# Altium schematic sheet MAIN.SchDoc: FM5006C
size A4; Date: 8/17/2024; Organization: Altium Limited; Address1: L3, 12a Rodborough Rd; Address2: Frenchs Forest; Address3: NSW; Address4: Australia 2086; Revision: 1; SheetNumber: 1; SheetTotal: 1; Application_BuildNumber: 1
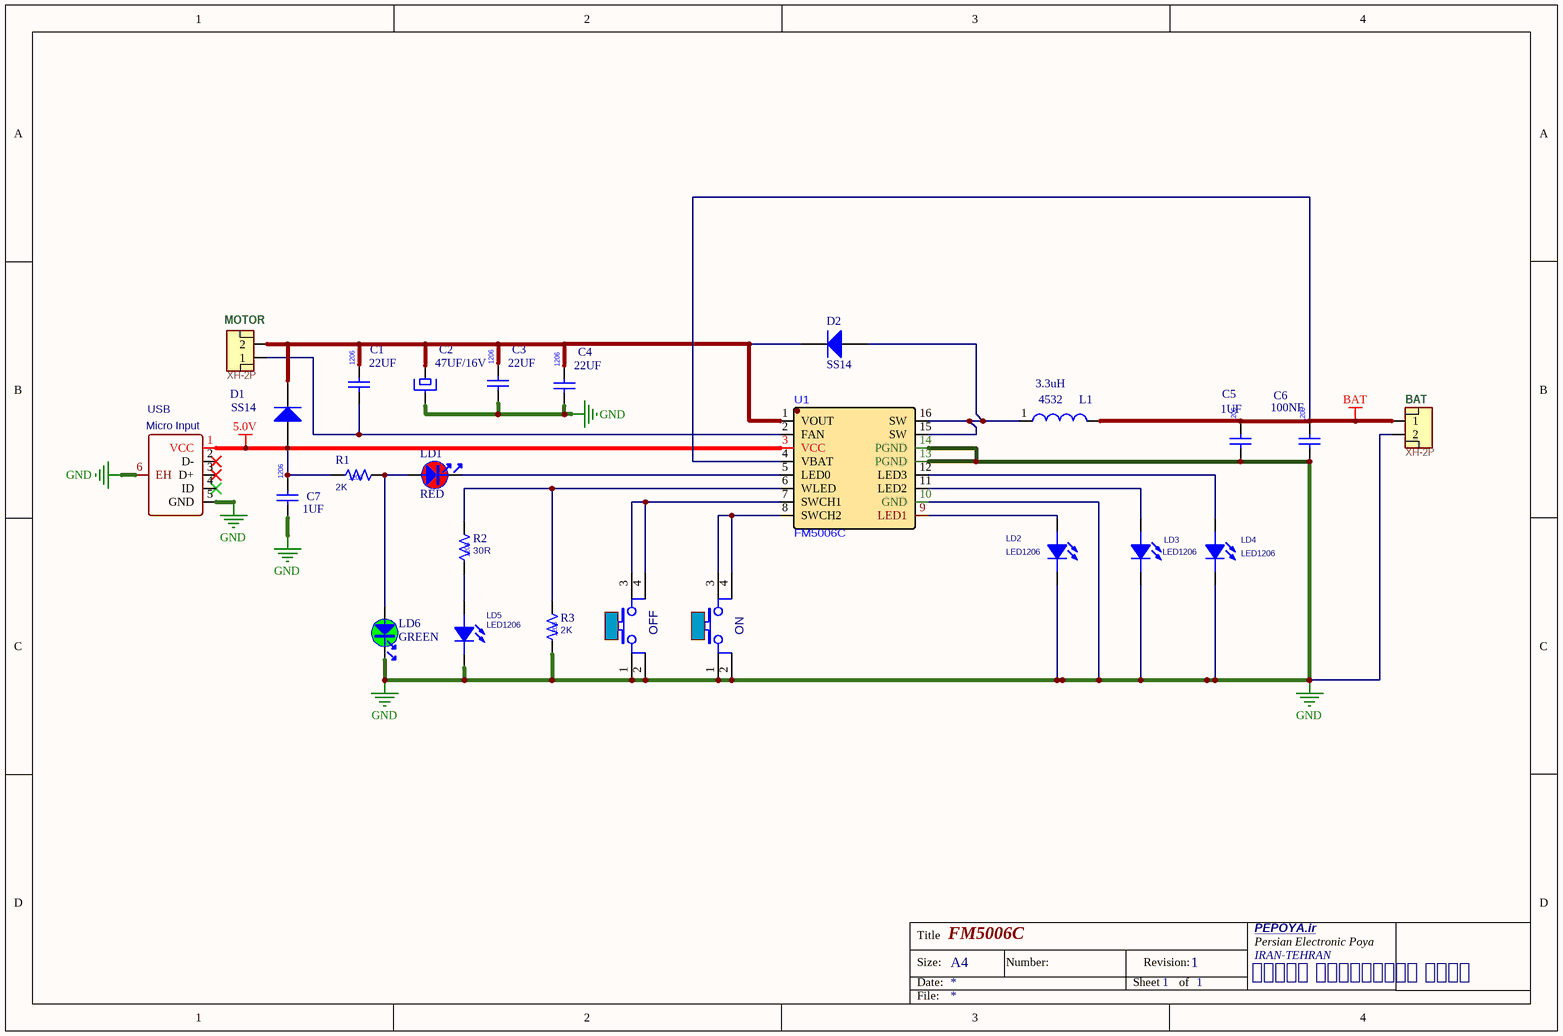
[diagram p0: MAIN.SchDoc]

## Parts
BAT  XH-2P  [XHB-2AW]
C1  22UF  [Cap1206 - duplicate]
C2  47UF/16V  [WCAP-AS5H 5x5.5x1.4]
C3  22UF  [Cap1206 - duplicate]
C4  22UF  [Cap1206 - duplicate]
C5  1UF  [Cap1206 - duplicate]
C6  100NF  [Cap1206 - duplicate]
C7  1UF  [Cap1206 - duplicate]
D1  SS14  [Diode 1N4007 SMD]
D2  SS14  [Diode 1N4007 SMD]
L1  3.3uH  Manufacturer Part Number: 4532  [Inductor 4532]
LD1  value RED  [LED 1206]  (hidden comment: LED_red)
LD2  LED1206  [LED 1206]
LD3  LED1206  [LED 1206]
LD4  LED1206  [LED 1206]
LD5  LED1206  [LED 1206]
LD6  value GREEN  [LED 1206]  (hidden comment: LED_green)
MOTOR  XH-2P  [XHB-2AW]
OFF  SW-PUSH-CMS_BLUE  [431471031826]  (value not drawn)
ON  SW-PUSH-CMS_BLUE  [431471031826]  (value not drawn)
R1  2K  [RES1206]
R2  30R  [RES1206]
R3  2K  [RES1206]
U1  FM5006C  [SOP-16]
USB  Micro Input  [USB MICRO]

## Nets
5.0V: C7.1 D1.1(A) R1.1 U1.3(VCC) USB.1(VCC)
BAT: BAT.1 C5.1 C6.1 L1.2 U1.4(VBAT)
GND: BAT.2 C2.2 C3.2 C4.2 C5.2 C6.2 C7.2 LD2.2(CATHODE) LD3.2(CATHODE) LD4.2(CATHODE) LD5.2(CATHODE) LD6.2 OFF.1 OFF.2 ON.1 ON.2 R3.1 U1.10(GND) U1.13(PGND) U1.14(PGND) USB.5(GND) USB.6(EH)
NetC1_1: C1.1 C2.1 C3.1 C4.1 D1.2(K) D2.2(K) MOTOR.2 U1.1(VOUT)
NetC1_2: C1.2 MOTOR.1 U1.2(FAN)
NetD2_1: D2.1(A) L1.1 U1.15(SW) U1.16(SW)
NetLD1_1: LD1.1 LD6.1 R1.2
NetLD1_2: LD1.2 U1.5(LED0)
NetLD2_1: LD2.1(ANODE) U1.9(LED1)
NetLD3_1: LD3.1(ANODE) U1.11(LED2)
NetLD4_1: LD4.1(ANODE) U1.12(LED3)
NetLD5_1: LD5.1(ANODE) R2.1
NetOFF_3: OFF.3 OFF.4 U1.7(SWCH1)
NetON_3: ON.3 ON.4 U1.8(SWCH2)
NetR2_2: R2.2 R3.2 U1.6(WLED)

Not connected (* = marked no-connect by the designer): USB 2(D-)* 3(D+)* 4(ID)*

## Notes on the sheet
- Title
- Size:
- Date:
- A4
- Number:
- Sheet
- Revision:
- of
- پرشین الکترونیک پویا
- PEPOYA.ir <http://PEPOYA.ir>
- Persian Electronic Poya
- IRAN-TEHRAN
- File:

## Library data of the parts
BAT MOTOR = JST-2: =Description
C1 C3-C5 C7 = C_1206: Manufacturer Part Number: 1206 100nF; Value: 100nF; DrownBy: Xavi.Rocher; Revised: Oriol.Cos; Package: 1206; Automotive: Y
C2 = EKRG250ETD101MF09D: 3.3uF 400V; Manufacturer: Wurth; Manufacturer Part Number: 860021373005; DrownBy: Xavi.Rocher; Revised: Oriol.Cos; Datasheet: https://www.mouser.es/datasheet/2/445/860021373005-1075178.pdf; Package: CER6; Supplier 1: Mouser; Value: 3.3uF 400V; Supplier Part Number 1: 710-860021373005
C6 = C_1206: Manufacturer Part Number: 1206 100nF; DrownBy: Xavi.Rocher; Revised: Oriol.Cos; Package: 1206; Value: 100nF; Automotive: Y
D1 D2 = DIODE_1N4148: High Conductance Fast Diode; Designer: Eng. Saeid Jorablo; Company: SJ Libraries; Published: 8-Jun-2000; LatestRevisionDate: 17-Jul-2002; LatestRevisionNote: Re-released for DXP Platform.; PackageReference: DO-35; Publisher: SJ Unlimited; PackageDescription: Diode, Axial; Body 3.8 x 1.9 mm (LxDia. max), Lead Dia. 0.53 mm (max); Code_JEDEC: DO-204-AH; ComponentLink1Description: Datasheet; ComponentLink1URL: http://www.fairchildsemi.com/; ComponentLink2Description: Reference; ComponentLink2URL: http://www.fairchildsemi.com/ds/1N%2F1N4148.pdf; Mounting Technology: Surface Mount\Through-Hole; HelpURL: http://s3.picofile.com/file/7443264187/Coming_Soon_logo.gif; Status: Unreleased
L1 = DR0608-105L: 1mH 0.43A DR0608; Manufacturer: BOURNS; Value: 1mH 0.3A; DrownBy: Xavi.Rocher; Revised: Oriol.Cos; Datasheet: http://www.farnell.com/datasheets/2360349.pdf?_ga=2.137143415.674541929.1556003454-804436753.1549448632; Package: DR0608; Supplier 1: Farnell; Supplier Part Number 1: 1929764
LD1 = MCD-02899: LED, Red, VF : Min=1.75V , Max=2.35V, 25mA, 0603; Part_Type: Display; Part_Preference: Recommended; Manufacturer: EVERLIGHT; Manufacturer_Part_Number: 19-213/R6C-AP1Q2B/5T; Full_Alternate_Internal_Part_Number: MCD-00049; Component_Country_Of_Origin: China; ShowFields: YES; ID: 5015; Internal_Part_Number: MCD-02899; Status: Checked; Package: 0603; ComponentLink1URL: http://tunmcdsvn.tun.st.com/Component_Documentation_Library/Trunk/Display/EVERLIGHT_19-213-R6C-AP1Q2B-5T; Order_Code_Digikey: 1080-19-213/R6C-AP1Q2B/5TTR-ND; Order_Code_Farnell: N/A; Order_Code_RS: N/A
LD2-LD5 = LED 5MM: Light Emitting Diode; Designer: Abbas Basereh; Data: 16-12-2016; Link: *; Part.No: *
LD6 = MCD-02900: LED, Green, 2V, 25mA, 0603, SMD; Part_Type: Display; Part_Preference: Recommended; Manufacturer: EVERLIGHT; Manufacturer_Part_Number: 19-213SYGC/S530-E2/5T; Full_Alternate_Internal_Part_Number: MCD-00320; Partial_Alternate_Internal_Part_Number: MCD-00050; Component_Country_Of_Origin: China; ShowFields: YES; ID: 5016; Internal_Part_Number: MCD-02900; Status: Checked; Package: 0603; ComponentLink1URL: http://tunmcdsvn.tun.st.com/Component_Documentation_Library/Trunk/Display/EVERLIGHT_19-213SYGC-S530-E2-5T; Order_Code_Digikey: 1080-19-213SYGC/S530-E2/5TTR-ND; Order_Code_Farnell: N/A; Order_Code_RS: N/A
OFF ON = MCD-00002: Non-Open Push-Button 0.1A 24V BLUE; Part_Type: Misc; Manufacturer: WEALTHMETAL; Value: SW_BLUE; Provided_By: Subcon; Initial_Board_Reference: MB1274; Internal_Part_Number: MCD-00002; Status: Released; ComponentLink1Description: Datasheet; ComponentLink1URL: http://tunmcdsvn.tun.st.com/Component_Datasheet_Library/Trunk/Misc/Wealthmetal_Tact-Switch_TD0341; Order_Code_Farnell: 535-930
R1-R3 = R_1206: Value: NS; DrownBy: Xavi.Rocher; Revised: Oriol.Cos; Package: 1206; Automotive: Y
U1 = FM5006C: SO-16
USB = Micro Input: Manufacturer: XKB Enterprise; Manufacturer Part: U254-051T-4BH23-S2B; Contributor: LCSC; Supplier: LCSC; Supplier Part: C319164; JLCPCB Part Class: Extended Part; spicePre: U; spiceSymbolName: U254-051T-4BH23-S2B